# Altium schematic sheet BlancerCar.SchDoc
size A4
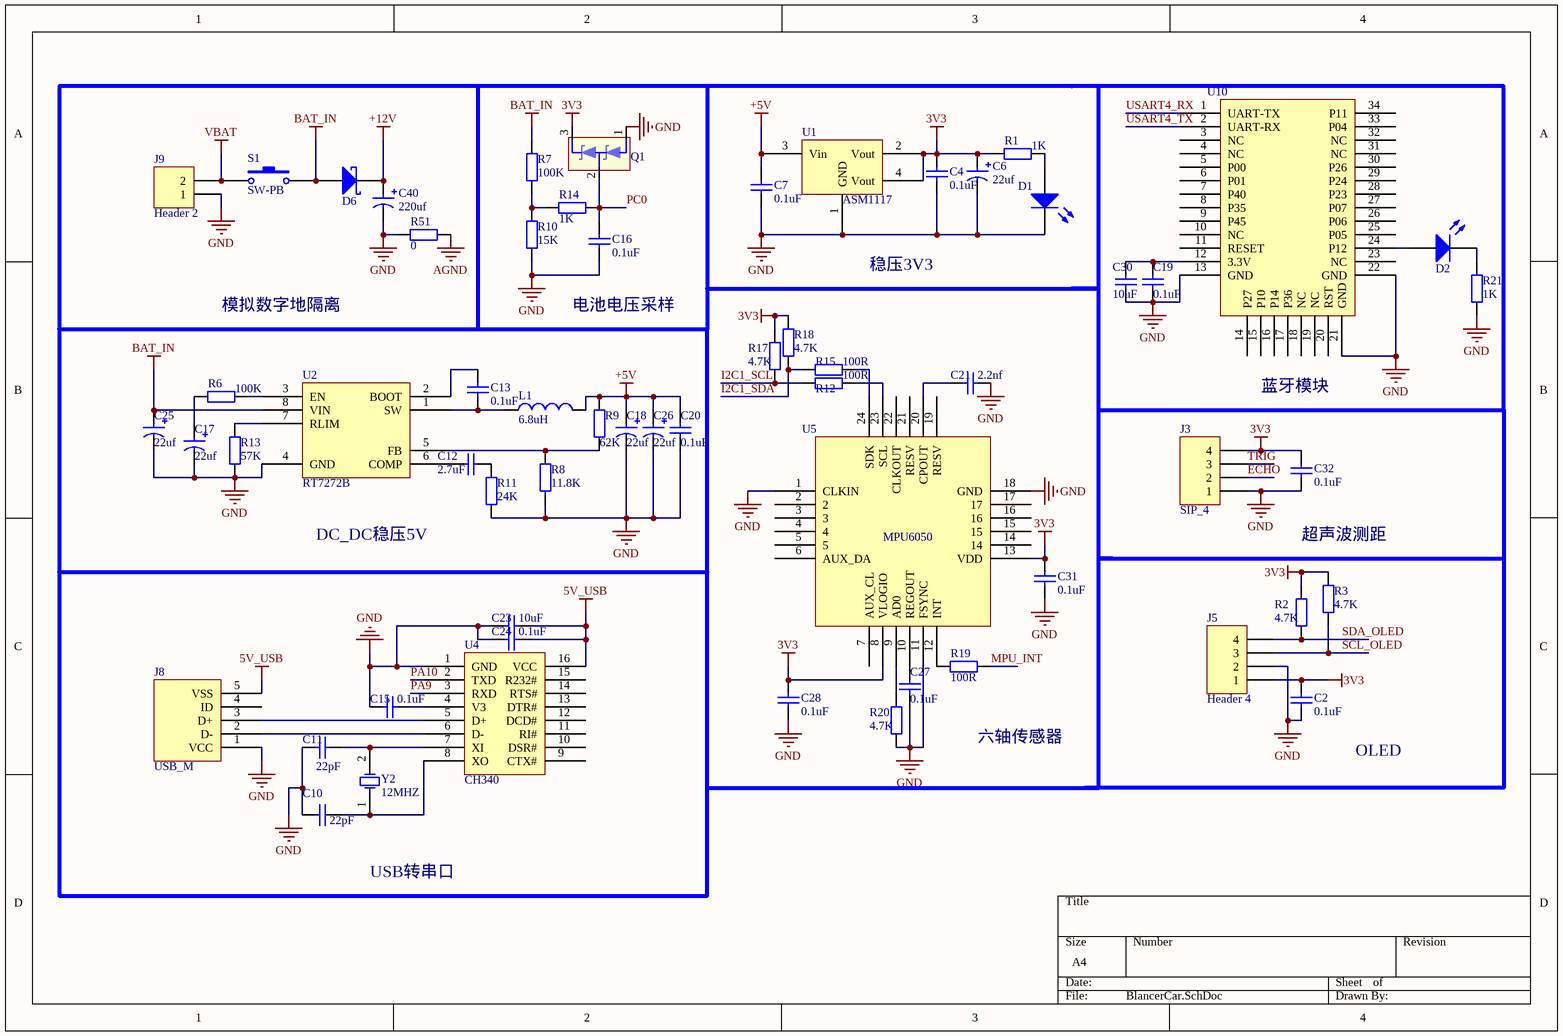
[diagram p0: BlancerCar.SchDoc]

## Parts
C2  value 0.1uF  [0805-1]  (hidden comment: Cap)
C4  value 0.1uF  [0805-1]  (hidden comment: Cap)
C6  value 22uf  [钽电容XDH]  (hidden comment: Cap钽电容)
C7  value 0.1uF  [0805-1]  (hidden comment: Cap)
C10  value 22pF  [0805-1]  (hidden comment: Cap)
C11  value 22pF  [0805-1]  (hidden comment: Cap)
C12  value 2.7uF  [0805-1]  (hidden comment: Cap)
C13  value 0.1uF  [0805-1]  (hidden comment: Cap)
C15  value 0.1uF  [0805-1]  (hidden comment: Cap)
C16  value 0.1uF  [0805-1]  (hidden comment: Cap)
C17  value 22uf  [钽电容XDH]  (hidden comment: Cap钽电容)
C18  value 22uf  [钽电容XDH]  (hidden comment: Cap钽电容)
C19  value 0.1uF  [0805-1]  (hidden comment: Cap)
C20  value 0.1uF  [0805-1]  (hidden comment: Cap)
C21  value 2.2nf  [0805-1]  (hidden comment: Cap)
C23  value 10uF  [0805-1]  (hidden comment: Cap)
C24  value 0.1uF  [0805-1]  (hidden comment: Cap)
C25  value 22uf  [钽电容XDH]  (hidden comment: Cap钽电容)
C26  value 22uf  [钽电容XDH]  (hidden comment: Cap钽电容)
C27  value 0.1uF  [0805-1]  (hidden comment: Cap)
C28  value 0.1uF  [0805-1]  (hidden comment: Cap)
C30  value 10uF  [0805-1]  (hidden comment: Cap)
C31  value 0.1uF  [0805-1]  (hidden comment: Cap)
C32  value 0.1uF  [0805-1]  (hidden comment: Cap)
C40  value 220uf  [电容220UF]  (hidden comment: Cap钽电容)
D1  LED0  [LED_0805]  (value not drawn)
D2  LED0  [LED_0805]  (value not drawn)
D6  肖基特二极管  [SS54]  (value not drawn)
J3  SIP_4  [HDR1X4]
J5  Header 4  [HDR1X4]
J8  USB_M  [USB_MICRO]
J9  Header 2  [T字公头]
L1  value 6.8uH  [33uh电感]  (hidden comment: Inductor)
Q1  肖基特二极管  [BAT54S(SOT-23-3)]  (value not drawn)
R1  value 1K  [0805-1]  (hidden comment: Res1)
R2  value 4.7K  [0805-1]  (hidden comment: Res1)
R3  value 4.7K  [0805-1]  (hidden comment: Res1)
R6  value 100K  [0805-1]  (hidden comment: Res1)
R7  value 100K  [0805-1]  (hidden comment: Res1)
R8  value 11.8K  [0805-1]  (hidden comment: Res1)
R9  value 62K  [0805-1]  (hidden comment: Res1)
R10  value 15K  [0805-1]  (hidden comment: Res1)
R11  value 24K  [0805-1]  (hidden comment: Res1)
R12  value 100R  [0805-1]  (hidden comment: Res1)
R13  value 57K  [0805-1]  (hidden comment: Res1)
R14  value 1K  [0805-1]  (hidden comment: Res1)
R15  value 100R  [0805-1]  (hidden comment: Res1)
R17  value 4.7K  [0805-1]  (hidden comment: Res1)
R18  value 4.7K  [0805-1]  (hidden comment: Res1)
R19  value 100R  [0805-1]  (hidden comment: Res1)
R20  value 4.7K  [0805-1]  (hidden comment: Res1)
R21  value 1K  [0805-1]  (hidden comment: Res1)
R51  value 0  [0805-1]  (hidden comment: Res1)
S1  SW-PB  [开关 6A]
U1  ASM1117  [ASM1117]
U2  RT7272B  [SOIC_8(LC)]
U4  CH340  [SOP16]
U5  MPU6050  [MPU6050]
U10  蓝牙模块  [LANYA]  (value not drawn)
Y2  12MHZ  [晶振 8M]

## Nets
3V3: C2.2 C4.2 C6.1 C28.2 C31.2 C32.2 J3.4 J5.1 Q1.3 R1.1 R2.2 R3.2 R17.2 R18.2 U1.2(Vout) U1.4(Vout) U5.8(VLOGIO) U5.13(VDD)
5V_USB: C23.2 C24.2 J8.5(VSS) U4.16(VCC)
+5V: C7.2 C18.1 C20.1 C26.1 L1.2 R9.2 U1.3(Vin)
+12V: C40.1 D6.2(K)
AGND: R51.2
BAT_IN: C25.1 D6.1(A) R7.2 S1.2 U2.8(VIN)
GND: C2.1 C4.1 C6.2 C7.1 C10.2 C11.2 C15.1 C16.1 C17.2 C18.2 C19.1 C20.2 C21.2 C23.1 C24.1 C25.2 C26.2 C27.1 C28.1 C30.1 C31.1 C32.1 C40.2 D1.2(K) J3.1 J5.2 J8.1(VCC) J9.1 Q1.1 R8.1 R10.1 R11.1 R13.1 R20.1 R21.1 R51.1 U1.1(GND) U2.4(GND) U4.1(GND) U5.1(CLKIN) U5.11(FSYNC) U5.18(GND) U10.13(GND) U10.21(GND) U10.22(GND)
VBAT: J9.2 S1.1
ECHO: J3.2
I2C1_SCL: R12.2 R17.1
I2C1_SDA: R15.2 R18.1
MPU_INT: R19.1
PA9: U4.3(RXD)
PA10: U4.2(TXD)
PC0: C16.2 Q1.2 R14.1
SCL_OLED: J5.3 R3.1
SDA_OLED: J5.4 R2.1
TRIG: J3.3
USART4_RX: U10.1(UART-TX)
USART4_TX: U10.2(UART-RX)
NetC10_1: C10.1 U4.8(XO) Y2.1(OSC1)
NetC11_1: C11.1 U4.7(XI) Y2.2(OSC2)
NetC12_1: C12.1 U2.6(COMP)
NetC12_2: C12.2 R11.2
NetC13_1: C13.1 L1.1 U2.1(SW)
NetC13_2: C13.2 U2.2(BOOT)
NetC15_2: C15.2 U4.4(V3)
NetC17_1: C17.1 R6.1
NetC19_2: C19.2 C30.2 U10.12(3.3V)
NetC21_1: C21.1 U5.20(CPOUT)
NetC27_2: C27.2 U5.10(REGOUT)
NetD1_1: D1.1(A) R1.2
NetD2_1: D2.1(A) U10.24(P12)
NetD2_2: D2.2(K) R21.2
NetJ8_2: J8.2(D-) U4.6(D-)
NetJ8_3: J8.3(D+) U4.5(D+)
NetR6_2: R6.2 U2.3(EN)
NetR7_1: R7.1 R10.2 R14.2
NetR8_2: R8.2 R9.1 U2.5(FB)
NetR12_1: R12.1 U5.23(SCL)
NetR13_2: R13.2 U2.7(RLIM)
NetR15_1: R15.1 U5.24(SDK)
NetR19_2: R19.2 U5.12(INT)
NetR20_2: R20.2 U5.9(AD0)

Not connected (* = marked no-connect by the designer): J8 4(ID); U4 9(CTX#) 10(DSR#) 11(RI#) 12(DCD#) 13(DTR#) 14(RTS#) 15(R232#); U5 2 3 4 5 6(AUX_DA) 7(AUX_CL) 14 15 16 17 19(RESV) 21(RESV) 22(CLKOUT); U10 3(NC) 4(NC) 5(P00) 6(P01) 7(P40) 8(P35) 9(P45) 10(NC) 11(RESET) 14(P27) 15(P10) 16(P14) 17(P36) 18(NC) 19(NC) 20(RST) 23(NC) 25(P05) 26(P06) 27(P07) 28(P23) 29(P24) 30(P26) 31(NC) 32(NC) 33(P04) 34(P11)

## Notes on the sheet
- 模拟数字地隔离
- 电池电压采样
- 稳压3V3
- 蓝牙模块
- DC_DC稳压5V
- 超声波测距
- 六轴传感器
- OLED
- USB转串口

## Library data of the parts
C2 C4 C7 C10-C13 C15 C16 C19-C21 C23 C24 C27 C28 C30-C32 = Cap: Capacitor; Published: 8-Jun-2000; LatestRevisionDate: 17-Jul-2002; LatestRevisionNote: Re-released for DXP Platform.; PackageReference: RAD-0.3; Publisher: Altium Limited
C6 C17 C18 C25 C26 C40 = Cap-dan
D1 D2 = LED0: 发光二极管; Published: 8-Jun-2000; LatestRevisionDate: 08-Jul-2005; LatestRevisionNote: Mech Layer 1 removed.; PackageReference: LED-0; Publisher: Altium Limited
D6 = SS54
J3 J5 = Header 4: Header, 4-Pin; LatestRevisionDate: 17-Jul-2002; LatestRevisionNote: Re-released for DXP Platform.; Publisher: Altium Limited
J8 = USB_M: MicroUSB接口
J9 = Header 2: Header, 2-Pin; LatestRevisionDate: 17-Jul-2002; LatestRevisionNote: Re-released for DXP Platform.; Publisher: Altium Limited
L1 = Inductor: Code_IEC: 1005; Published: 8-Jun-2000; LatestRevisionDate: 29-May-2009; LatestRevisionNote: IPC-7351 Footprint Added.; PackageReference: 0402-A; Publisher: Altium Limited; PackageDescription: Chip Inductor; Code_JEITA: 0402
Q1 = BAT54S
R1-R3 R6-R15 R17-R21 R51 = Res1: 贴片电阻; Published: 8-Jun-2000; LatestRevisionDate: 17-Jul-2002; LatestRevisionNote: Re-released for DXP Platform.; PackageReference: AXIAL-0.4; Publisher: Altium Limited
S1 = SW-PB: Switch; Published: 24-Mar-1999; LatestRevisionDate: 17-Jul-2002; LatestRevisionNote: Re-released for DXP Platform.; PackageReference: SPST-2; Publisher: Altium Limited; PackageDescription: Switch; 2 Leads
U2 = RT7272B: RT7272B同步降压型DC-DC转换器
U5 = MPU6050_
U10 = 蓝牙
Y2 = XTAL: Crystal Oscillator; Published: 8-Jun-2000; LatestRevisionDate: 17-Jul-2002; LatestRevisionNote: Re-released for DXP Platform.; PackageReference: R38; Publisher: Altium Limited; PackageDescription: Crystal, Thru-Hole; 2 Leads; Body 3.1 x 8.2 mm (Dia.xH)